# EAGLE design rs232 (EAGLE 6.3)
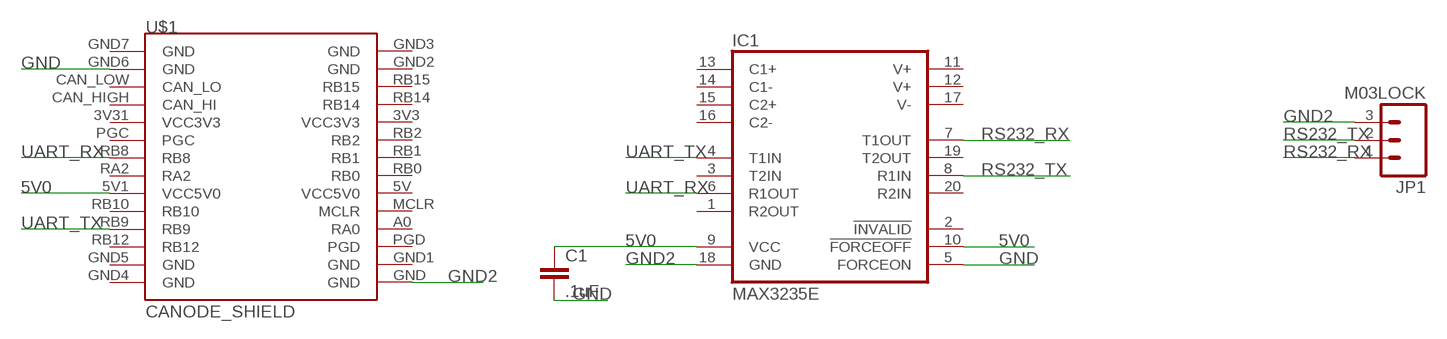
[diagram p0: schematic, sheet 1]

## Parts
C1  .1uF  CAP1206  [1206]
IC1  MAX3235E  [SO20L]
JP1  M03LOCK  [1X03_LOCK]
U$1  CANODE_SHIELD  [CANODE_SHIELD]

## Nets
5V0 [power]: C1.1 IC1.9(VCC) IC1.10(!FORCEOFF) U$1.5V1(VCC5V0)
GND [power]: C1.2 IC1.5(FORCEON) U$1.GND6(GND)
GND2 [power]: IC1.18(GND) JP1.3 U$1.GND
RS232_RX: IC1.7(T1OUT) JP1.1
RS232_TX: IC1.8(R1IN) JP1.2
UART_RX [small]: IC1.6(R1OUT) U$1.RB8
UART_TX [small]: IC1.4(T1IN) U$1.RB9
Unconnected: IC1.1(R2OUT) IC1.2(!INVALID) IC1.3(T2IN) IC1.11(V+) IC1.12(V+) IC1.13(C1+) IC1.14(C1-) IC1.15(C2+) IC1.16(C2-) IC1.17(V-) IC1.19(T2OUT) IC1.20(R2IN) U$1.3V3(VCC3V3) U$1.3V31(VCC3V3) U$1.5V(VCC5V0) U$1.A0(RA0) U$1.CAN_HIGH(CAN_HI) U$1.CAN_LOW(CAN_LO) U$1.GND1(GND) U$1.GND2(GND) U$1.GND3(GND) U$1.GND4(GND) U$1.GND5(GND) U$1.GND7(GND) U$1.MCLR U$1.PGC U$1.PGD U$1.RA2 U$1.RB0 U$1.RB1 U$1.RB2 U$1.RB10 U$1.RB12 U$1.RB14 U$1.RB15

## Library data of the parts
C1 = ASL:CAP: Capacitor Standard 0603 ceramic capacitor, and 0.1" leaded capacitor.
IC1 = ASL:MAX3235E: ±15kV ESD-Protected, 1µA, 250kbps, 3.3V/5V, Dual RS-232 Transceivers with Internal Capacitors; MF: MAXIM; MPN: MAX3235E; OC_FARNELL: 9725547; OC_NEWARK: 28K3302
JP1 = ASL:M03: Header 3 Standard 3-pin 0.1" header. Use with straight break away headers (SKU : PRT-00116), right angle break away headers (PRT-00553), swiss pins (PRT-00743), machine pins (PRT-00117), and female headers (PRT-00115). Molex polarized connector foot print use with SKU : PRT-08232 with associated crimp pins and housings.
U$1 = ASL:CANODE_SHIELD: This part provides an outline of the CANode to facilitate developing shield boards. Note that this does not show the position of the mounting holes for the 4-40 screws, which should be .12" holes centered in the 4 circles in the corners.

## Net classes
0 default: width 0.406 mm
1 small: width 0.203 mm
2 power: width 0.762 mm

## Board
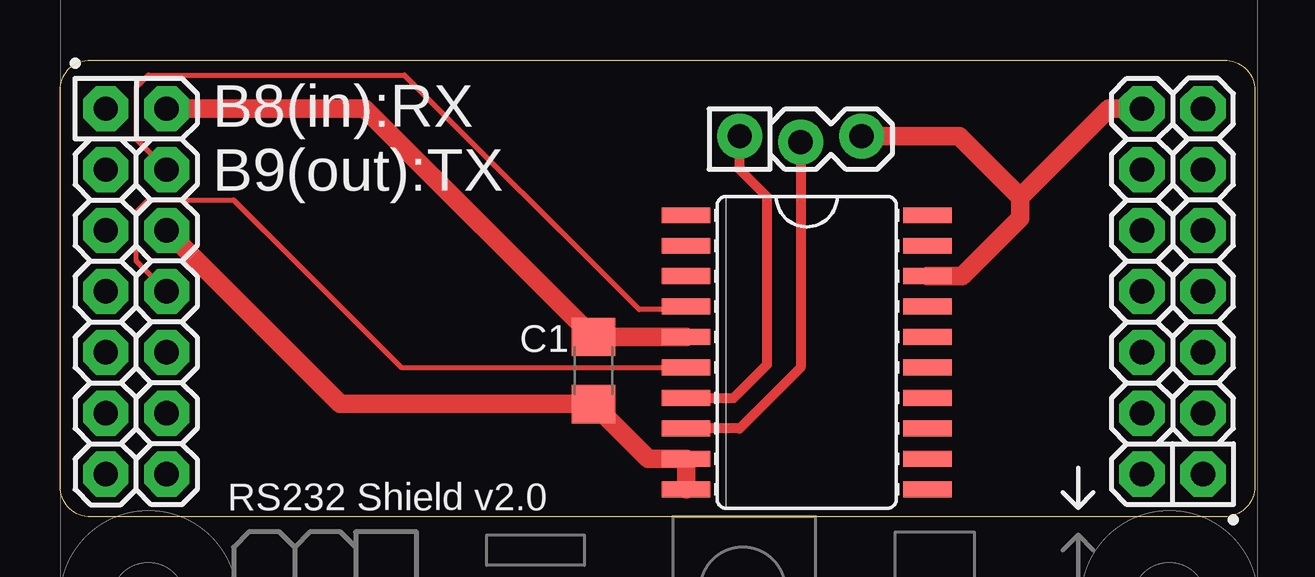
[diagram p1: board, top side]

Size 49.78 x 19.05 mm. Coordinates in mm from the lower left corner, seen from the top.
Outline: 48.51,0 1.27,0 arc-90 0,1.27 0,17.78 arc-90 1.27,19.05 48.51,19.05 arc-90 49.78,17.78 49.78,1.27 arc-90 48.51,0
Copper layers (1*16): Top 0.035mm / dielectric 1.5mm / Bottom 0.035mm
Design rules "SparkFun": minimum track width 8mil, minimum drill 20mil, track to track 8mil, track to pad 8mil, pad to pad 8mil, via to via 8mil, smd to smd 8mil, copper to edge 10mil, drill to drill 8mil, minimum pad ring 12mil, minimum via ring 10mil, stop-mask expansion 4mil, vias tented up to drill 25mil, thermal gap 10mil

### Footprints (pad centres in the part's own frame; a part is rotated, then mirrored left to right if it is on the bottom)
1206 = smd 1.6 x 1.8: 1 -1.4,0; 2 1.4,0
SO20L = smd 0.66 x 2.032: 1 -5.715,-5.029; 2 -4.445,-5.029; 3 -3.175,-5.029; 4 -1.905,-5.029; 5 -0.635,-5.029; 6 0.635,-5.029; 7 1.905,-5.029; 8 3.175,-5.029; 9 4.445,-5.029; 10 5.715,-5.029; 11 5.715,5.029; 12 4.445,5.029; 13 3.175,5.029; 14 1.905,5.029; 15 0.635,5.029; 16 -0.635,5.029; 17 -1.905,5.029; 18 -3.175,5.029; 19 -4.445,5.029; 20 -5.715,5.029
1X03_LOCK = drill 1.016 pad 1.88: 1 0,0.127; 2 2.54,-0.127; 3 5.08,0.127
CANODE_SHIELD = drill 1.016 pad 1.88 octagon: 3V3 45.085,19.05; 3V31 4.445,13.97; 5V 45.085,13.97; 5V1 4.445,19.05; A0 45.085,11.43; CAN_HIGH 1.905,11.43; CAN_LOW 4.445,11.43; GND 45.085,24.13; GND1 47.625,24.13; GND2 45.085,8.89; GND3 47.625,8.89; GND4 4.445,8.89; GND5 1.905,8.89; GND6 4.445,24.13; GND7 1.905,24.13; MCLR 47.625,13.97; PGC 1.905,13.97; PGD 47.625,11.43; RA2 1.905,16.51; RB0 47.625,16.51; RB1 45.085,16.51; RB2 47.625,19.05; RB8 4.445,16.51; RB9 4.445,21.59; RB10 1.905,19.05; RB12 1.905,21.59; RB14 47.625,21.59; RB15 45.085,21.59

### Placement (x,y rotation side)
C1  22.23,6.1 90 top
IC1  31.11,6.86 270 top
JP1  28.32,15.75 0 top
U$1  0,-7.11 0 top

### Tracks (layer width: path | path; a pad name or v marks a point on that pad's centre or on a via)
5V0
  Top 0.762: U$1.5V1 11.69,4.7 C1.1 24.51,2.41 IC1.9 IC1.10
GND
  Top 0.762: U$1.GND6 12.7,17.02 C1.2 22.48,7.49 IC1.5
GND2
  Top 0.762: JP1.3 37.47,15.87 40.01,13.33 | 40.01,13.33 40.01,12.45 37.59,10.03 IC1.18 | 40.01,13.33 43.69,17.02 U$1.GND
RS232_RX
  Top 0.406: IC1.7 28.07,4.95 29.46,6.35 29.46,13.33 28.32,14.48 JP1.1
RS232_TX
  Top 0.406: JP1.2 30.86,6.22 28.32,3.68 IC1.8
UART_RX
  Top 0.203: U$1.RB8 3.17,10.67 3.17,12.7 3.68,13.21 7.24,13.21 14.22,6.22 IC1.6
UART_TX
  Top 0.203: U$1.RB9 3.17,15.75 3.17,17.91 3.68,18.41 14.35,18.41 24.13,8.64 26.21,8.64 IC1.4

### Text on the board
tPlace: B8(in):RX / B9(out):TX | RS232 Shield v2.0
tDocu: RX | TX | GND